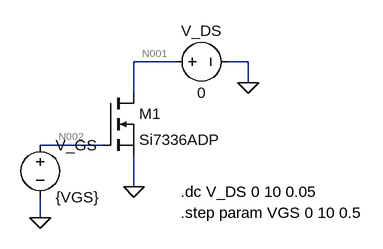
[diagram p0: schematic mosfet.asc]
mosfet.asc, the LTspice schematic file:
Version 4.1
SHEET 1 880 680
WIRE 256 80 192 80
WIRE 368 80 336 80
WIRE 368 112 368 80
WIRE 192 128 192 80
WIRE 144 208 48 208
WIRE 192 272 192 224
WIRE 48 320 48 288
FLAG 192 272 0
FLAG 48 320 0
FLAG 368 112 0
SYMBOL nmos 144 128 R0
SYMATTR InstName M1
SYMATTR Value Si7336ADP
SYMBOL voltage 48 192 R0
WINDOW 123 0 0 Left 0
WINDOW 39 0 0 Left 0
SYMATTR InstName V_GS
SYMATTR Value {VGS}
SYMBOL voltage 240 80 R270
WINDOW 0 32 56 VTop 2
WINDOW 3 -32 56 VBottom 2
WINDOW 123 0 0 Left 0
WINDOW 39 0 0 Left 0
SYMATTR InstName V_DS
SYMATTR Value 0
TEXT 264 280 Left 2 !.dc V_DS 0 10 0.05
TEXT 264 312 Left 2 !.step param VGS 0 10 0.5

The netlist it stands for:
* mosfet.asc
M1 N001 N002 0 0 Si7336ADP
V_GS N002 0 {VGS}
V_DS N001 0 0
.model NMOS NMOS
.model PMOS PMOS
.lib standard.mos
.dc V_DS 0 10 0.05
.step param VGS 0 10 0.5
.backanno
.end

* Results of the author's LTspice run, read from the files saved beside the schematic
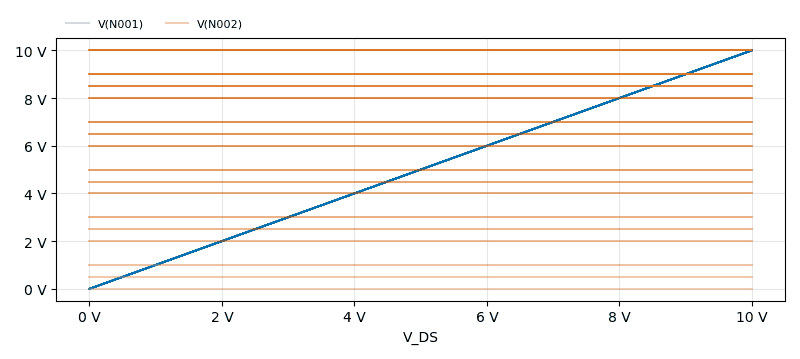
[diagram p1: DC transfer characteristic of mosfet.asc, plotted from the saved traces]
* DC transfer characteristic, 21 runs:
*   V(N001) [run 1]: 0 V at V_DS=0 V, 10 V at V_DS=10 V, min 0 V, max 10 V
*   V(N001) [run 2]: 0 V at V_DS=0 V, 10 V at V_DS=10 V, min 0 V, max 10 V
*   V(N001) [run 3]: 0 V at V_DS=0 V, 10 V at V_DS=10 V, min 0 V, max 10 V
*   V(N001) [run 4]: 0 V at V_DS=0 V, 10 V at V_DS=10 V, min 0 V, max 10 V
*   V(N001) [run 5]: 0 V at V_DS=0 V, 10 V at V_DS=10 V, min 0 V, max 10 V
*   V(N001) [run 6]: 0 V at V_DS=0 V, 10 V at V_DS=10 V, min 0 V, max 10 V
*   V(N001) [run 7]: 0 V at V_DS=0 V, 10 V at V_DS=10 V, min 0 V, max 10 V
*   V(N001) [run 8]: 0 V at V_DS=0 V, 10 V at V_DS=10 V, min 0 V, max 10 V
*   V(N002) [run 1]: 0 V at V_DS=0 V, 0 V at V_DS=10 V, min 0 V, max 0 V
*   V(N002) [run 2]: 500 mV at V_DS=0 V, 500 mV at V_DS=10 V, min 500 mV, max 500 mV
*   V(N002) [run 3]: 1 V at V_DS=0 V, 1 V at V_DS=10 V, min 1 V, max 1 V
*   V(N002) [run 4]: 2 V at V_DS=0 V, 2 V at V_DS=10 V, min 2 V, max 2 V
*   V(N002) [run 5]: 2.5 V at V_DS=0 V, 2.5 V at V_DS=10 V, min 2.5 V, max 2.5 V
*   V(N002) [run 6]: 3 V at V_DS=0 V, 3 V at V_DS=10 V, min 3 V, max 3 V
*   V(N002) [run 7]: 4 V at V_DS=0 V, 4 V at V_DS=10 V, min 4 V, max 4 V
*   V(N002) [run 8]: 4.5 V at V_DS=0 V, 4.5 V at V_DS=10 V, min 4.5 V, max 4.5 V